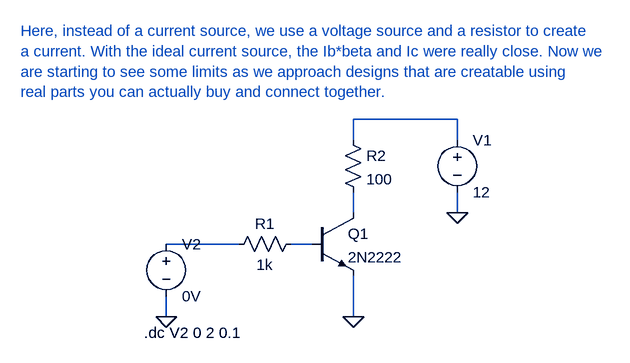
[diagram p0: schematic BaseBias02.asc]
BaseBias02.asc, the LTspice schematic file:
Version 4
SHEET 1 880 680
WIRE 400 -32 240 -32
WIRE 240 0 240 -32
WIRE 400 0 400 -32
WIRE 240 112 240 80
WIRE 400 112 400 80
WIRE 64 160 -48 160
WIRE 176 160 144 160
WIRE -48 272 -48 240
WIRE 240 272 240 208
FLAG 400 112 0
FLAG 240 272 0
FLAG -48 272 0
SYMBOL npn 176 112 R0
SYMATTR InstName Q1
SYMATTR Value 2N2222
SYMBOL res 48 176 R270
WINDOW 0 32 56 VTop 2
WINDOW 3 0 56 VBottom 2
SYMATTR InstName R1
SYMATTR Value 1k
SYMBOL res 224 -16 R0
SYMATTR InstName R2
SYMATTR Value 100
SYMBOL voltage 400 -16 R0
WINDOW 123 0 0 Left 0
WINDOW 39 0 0 Left 0
SYMATTR InstName V1
SYMATTR Value 12
SYMBOL voltage -48 144 R0
WINDOW 123 0 0 Left 0
WINDOW 39 0 0 Left 0
SYMATTR InstName V2
SYMATTR Value 0V
TEXT -82 296 Left 2 !.dc V2 0 2 0.1
TEXT -272 -168 Left 2 ;Here, instead of a current source, we use a voltage source and a resistor to create\na current. With the ideal current source, the Ib*beta and Ic were really close. Now we\nare starting to see some limits as we approach designs that are creatable using\nreal parts you can actually buy and connect together.

The netlist it stands for:
* BaseBias02.asc
Q1 N002 N004 0 0 2N2222
R1 N003 N004 1k
R2 N001 N002 100
V1 N001 0 12
V2 N003 0 0V
.model NPN NPN
.model PNP PNP
.lib standard.bjt
.dc V2 0 2 0.1
* Here, instead of a current source, we use a voltage source and a resistor to create
* a current. With the ideal current source, the Ib*beta and Ic were really close. Now we
* are starting to see some limits as we approach designs that are creatable using
* real parts you can actually buy and connect together.
.backanno
.end